# EAGLE design armstrap_eagle_1.0.0 (EAGLE 6.3)
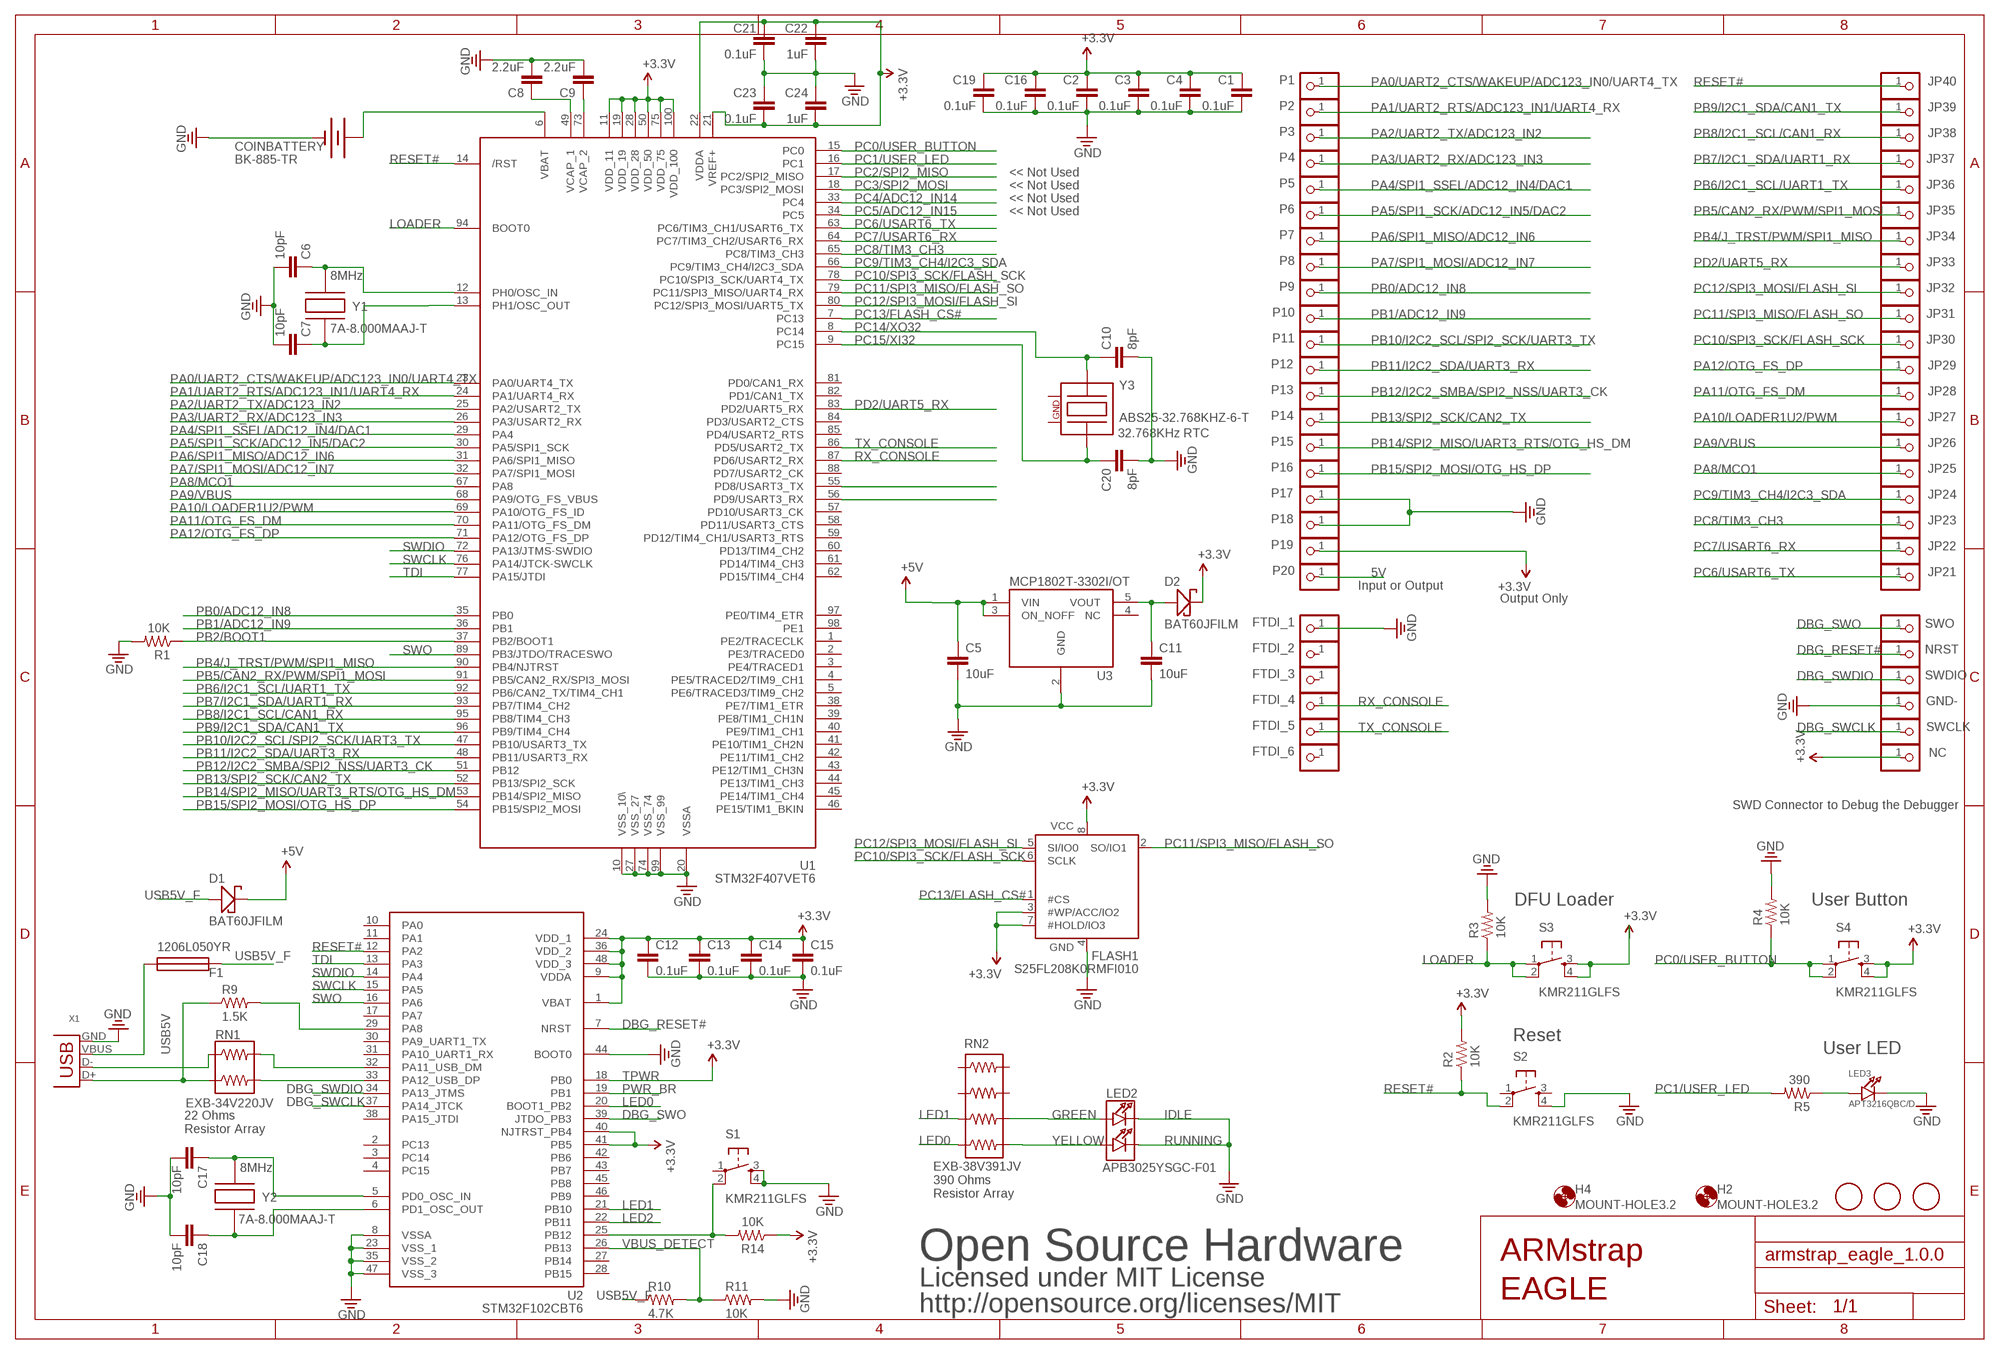
[diagram p0: schematic, sheet 1]

## Parts
C1  0.1uF  CAP0805  [0805]
C2  0.1uF  CAP0805  [0805]
C3  0.1uF  CAP0805  [0805]
C4  0.1uF  CAP0805  [0805]
C5  10uF  CAP0805  [0805]
C6  10pF  CAP0805  [0805]
C7  10pF  CAP0805  [0805]
C8  2.2uF  CAP0805  [0805]
C9  2.2uF  CAP0805  [0805]
C10  8pF  CAP0805  [0805]
C11  10uF  CAP0805  [0805]
C12  0.1uF  CAP0805  [0805]
C13  0.1uF  CAP0805  [0805]
C14  0.1uF  CAP0805  [0805]
C15  0.1uF  CAP0805  [0805]
C16  0.1uF  CAP0805  [0805]
C17  10pF  CAP0805  [0805]
C18  10pF  CAP0805  [0805]
C19  0.1uF  CAP0805  [0805]
C20  8pF  CAP0805  [0805]
C21  0.1uF  CAP0805  [0805]
C22  1uF  CAP0805  [0805]
C23  0.1uF  CAP0805  [0805]
C24  1uF  CAP0805  [0805]
COINBATTERY  BK-885-TR  BATTERY12MM  [BATTCON_12MM]
D1  BAT60JFILM  SCHOTTKY  [SOD-323]
D2  BAT60JFILM  SCHOTTKY  [SOD-323]
F1  1206L050YR  FUSE_PTC  [PTC-1206]
FID2  FIDUCIAL  [FIDUCIAL_1MM]
FID3  FIDUCIAL  [FIDUCIAL_1MM]
FID4  FIDUCIAL  [FIDUCIAL_1MM]
FLASH1  S25FL208K0RMFI010  FLASH-SPI  [SOIC-8-WIDE]
FTDI_1  PINHD-1X1  [1X01]
FTDI_2  PINHD-1X1  [1X01]
FTDI_3  PINHD-1X1  [1X01]
FTDI_4  PINHD-1X1  [1X01]
FTDI_5  PINHD-1X1  [1X01]
FTDI_6  PINHD-1X1  [1X01]
GND-  PINHD-1X1  [1X01]
H2  MOUNT-HOLE3.2  [3,2]
H4  MOUNT-HOLE3.2  [3,2]
JP21  PINHD-1X1  [1X01]
JP22  PINHD-1X1  [1X01]
JP23  PINHD-1X1  [1X01]
JP24  PINHD-1X1  [1X01]
JP25  PINHD-1X1  [1X01]
JP26  PINHD-1X1  [1X01]
JP27  PINHD-1X1  [1X01]
JP28  PINHD-1X1  [1X01]
JP29  PINHD-1X1  [1X01]
JP30  PINHD-1X1  [1X01]
JP31  PINHD-1X1  [1X01]
JP32  PINHD-1X1  [1X01]
JP33  PINHD-1X1  [1X01]
JP34  PINHD-1X1  [1X01]
JP35  PINHD-1X1  [1X01]
JP36  PINHD-1X1  [1X01]
JP37  PINHD-1X1  [1X01]
JP38  PINHD-1X1  [1X01]
JP39  PINHD-1X1  [1X01]
JP40  PINHD-1X1  [1X01]
LED2  APB3025YSGC-F01  LED-2  [CHIPLED_1206-DUAL]
LED3  APT3216QBC/D  LED1206  [CHIPLED_1206]
NC  PINHD-1X1  [1X01]
NRST  PINHD-1X1  [1X01]
P1  PINHD-1X1  [1X01]
P2  PINHD-1X1  [1X01]
P3  PINHD-1X1  [1X01]
P4  PINHD-1X1  [1X01]
P5  PINHD-1X1  [1X01]
P6  PINHD-1X1  [1X01]
P7  PINHD-1X1  [1X01]
P8  PINHD-1X1  [1X01]
P9  PINHD-1X1  [1X01]
P10  PINHD-1X1  [1X01]
P11  PINHD-1X1  [1X01]
P12  PINHD-1X1  [1X01]
P13  PINHD-1X1  [1X01]
P14  PINHD-1X1  [1X01]
P15  PINHD-1X1  [1X01]
P16  PINHD-1X1  [1X01]
P17  PINHD-1X1  [1X01]
P18  PINHD-1X1  [1X01]
P19  PINHD-1X1  [1X01]
P20  PINHD-1X1  [1X01]
R1  10K  RES0805  [0805]
R2  10K  RES0805  [0805]
R3  10K  RES0805  [0805]
R4  10K  RES0805  [0805]
R5  390  RES0805  [0805]
R9  1.5K  RES0805  [0805]
R10  4.7K  RES0805  [0805]
R11  10K  RES0805  [0805]
R14  10K  RES0805  [0805]
RN1  EXB-34V220JV  RES-2  [0603-ARC2]
RN2  EXB-38V391JV  RES-4  [0603-ARC4]
S1  KMR211GLFS  TAC_SWITCH  [KMR_SWITCH]
S2  KMR211GLFS  TAC_SWITCH  [KMR_SWITCH]
S3  KMR211GLFS  TAC_SWITCH  [KMR_SWITCH]
S4  KMR211GLFS  TAC_SWITCH  [KMR_SWITCH]
SWCLK  PINHD-1X1  [1X01]
SWDIO  PINHD-1X1  [1X01]
SWO  PINHD-1X1  [1X01]
U1  STM32F407VET6  [LQFP100]
U2  STM32F102CBT6  [LQFP48]
U3  MCP1802T-3302I/OT  MCP1802  [MCP1802-SOT23]
X1  10033526-N3212MLF  USB-MB-S  [USB-MB-S]
Y1  7A-8.000MAAJ-T  CRYSTAL-2  [CRYSTAL-SMD-5.0MM-3.2MM-2]
Y2  7A-8.000MAAJ-T  CRYSTAL-2  [CRYSTAL-SMD-5.0MM-3.2MM-2]
Y3  ABS25-32.768KHZ-6-T  CRYSTAL  [CRYSTAL-SMD-32.768KHZ]

## Nets
3.3V: C1.1 C2.1 C3.1 C4.1 C12.1 C13.1 C14.1 C15.1 C16.1 C19.1 C21.1 C22.1 C23.2 C24.2 D2.CATHODE(C) FLASH1.3(#WP/ACC/IO2) FLASH1.7(#HOLD/IO3) FLASH1.8(VCC) NC.1 P19.1 R2.2 R14.1 S3.3 S3.4 S4.3 S4.4 U1.11(VDD_11) U1.19(VDD_19) U1.21(VREF+) U1.22(VDDA) U1.28(VDD_28) U1.50(VDD_50) U1.75(VDD_75) U1.100(VDD_100) U2.1(VBAT) U2.9(VDDA) U2.18(PB0) U2.24(VDD_1) U2.36(VDD_2) U2.40(NJTRST_PB4) U2.41(PB5) U2.48(VDD_3) ; supply symbol labelled +3.3V
5V: C5.1 D1.CATHODE(C) P20.1 U3.1(VIN) U3.3(ON_NOFF) ; supply symbol labelled +5V
DBG_RESET#: NRST.1 U2.7(NRST)
DBG_SWCLK: SWCLK.1 U2.37(PA14_JTCK)
DBG_SWDIO: SWDIO.1 U2.34(PA13_JTMS)
DBG_SWO: SWO.1 U2.39(JTDO_PB3)
GND [power]: C1.2 C2.2 C3.2 C4.2 C5.2 C6.2 C7.2 C8.2 C9.2 C10.2 C11.2 C12.2 C13.2 C14.2 C15.2 C16.2 C17.2 C18.2 C19.2 C20.2 C21.2 C22.2 C23.1 C24.1 COINBATTERY.GND(-) FLASH1.4(GND) FTDI_1.1 GND-.1 LED2.2 LED2.4 LED3.C P17.1 P18.1 R1.2 R3.2 R4.2 R11.2 S1.3 S1.4 S2.4 U1.10(VSS_10\) U1.20(VSSA) U1.27(VSS_27) U1.74(VSS_74) U1.99(VSS_99) U2.8(VSSA) U2.23(VSS_1) U2.35(VSS_2) U2.44(BOOT0) U2.47(VSS_3) U3.2(GND) X1.GND
LED0: RN2.4 U2.20(BOOT1_PB2)
LED1: RN2.3 U2.21(PB10)
LED2: U2.22(PB11)
LOADER: R3.1 S3.1 S3.2 U1.94(BOOT0)
N$1: C7.1 U1.13(PH1/OSC_OUT) Y1.2
N$2: C9.1 U1.73(VCAP_2)
N$3: U1.55(PD8/USART3_TX)
N$4: C17.1 U2.5(PD0_OSC_IN) Y2.1
N$6: R9.2 U2.29(PA8)
N$8: R9.1 RN1.2 X1.D+
N$9: RN1.3 U2.33(PA12_USB_DP)
N$10: RN1.1 X1.D-
N$11: RN1.4 U2.32(PA11_USB_DM)
N$12: C11.1 D2.ANODE(A) U3.5(VOUT)
N$13: C18.1 U2.6(PD1_OSC_OUT) Y2.2
N$16: U1.56(PD9/USART3_RX)
N$17: R14.2 S1.2 U2.25(PB12)
N$20: LED3.A R5.1
N$23: LED2.3 RN2.6
N$25: LED2.1 RN2.5
N$81: C8.1 U1.49(VCAP_1)
PA0/UART2_CTS/WAKEUP/ADC123_IN0/UART4_TX: P1.1 U1.23(PA0/UART4_TX)
PA1/UART2_RTS/ADC123_IN1/UART4_RX: P2.1 U1.24(PA1/UART4_RX)
PA2/UART2_TX/ADC123_IN2: P3.1 U1.25(PA2/USART2_TX)
PA3/UART2_RX/ADC123_IN3: P4.1 U1.26(PA3/USART2_RX)
PA4/SPI1_SSEL/ADC12_IN4/DAC1: P5.1 U1.29(PA4)
PA5/SPI1_SCK/ADC12_IN5/DAC2: P6.1 U1.30(PA5/SPI1_SCK)
PA6/SPI1_MISO/ADC12_IN6: P7.1 U1.31(PA6/SPI1_MISO)
PA7/SPI1_MOSI/ADC12_IN7: P8.1 U1.32(PA7/SPI1_MOSI)
PA8/MCO1: JP25.1 U1.67(PA8)
PA9/VBUS: JP26.1 U1.68(PA9/OTG_FS_VBUS)
PA10/LOADER1U2/PWM: JP27.1 U1.69(PA10/OTG_FS_ID)
PA11/OTG_FS_DM: JP28.1 U1.70(PA11/OTG_FS_DM)
PA12/OTG_FS_DP: JP29.1 U1.71(PA12/OTG_FS_DP)
PB0/ADC12_IN8: P9.1 U1.35(PB0)
PB1/ADC12_IN9: P10.1 U1.36(PB1)
PB2/BOOT1: R1.1 U1.37(PB2/BOOT1)
PB4/J_TRST/PWM/SPI1_MISO: JP34.1 U1.90(PB4/NJTRST)
PB5/CAN2_RX/PWM/SPI1_MOSI: JP35.1 U1.91(PB5/CAN2_RX/SPI3_MOSI)
PB6/I2C1_SCL/UART1_TX: JP36.1 U1.92(PB6/CAN2_TX/TIM4_CH1)
PB7/I2C1_SDA/UART1_RX: JP37.1 U1.93(PB7/TIM4_CH2)
PB8/I2C1_SCL/CAN1_RX: JP38.1 U1.95(PB8/TIM4_CH3)
PB9/I2C1_SDA/CAN1_TX: JP39.1 U1.96(PB9/TIM4_CH4)
PB10/I2C2_SCL/SPI2_SCK/UART3_TX: P11.1 U1.47(PB10/USART3_TX)
PB11/I2C2_SDA/UART3_RX: P12.1 U1.48(PB11/USART3_RX)
PB12/I2C2_SMBA/SPI2_NSS/UART3_CK: P13.1 U1.51(PB12)
PB13/SPI2_SCK/CAN2_TX: P14.1 U1.52(PB13/SPI2_SCK)
PB14/SPI2_MISO/UART3_RTS/OTG_HS_DM: P15.1 U1.53(PB14/SPI2_MISO)
PB15/SPI2_MOSI/OTG_HS_DP: P16.1 U1.54(PB15/SPI2_MOSI)
PC0/USER_BUTTON: R4.1 S4.1 S4.2 U1.15(PC0)
PC1/USER_LED: R5.2 U1.16(PC1)
PC2/SPI2_MISO: U1.17(PC2/SPI2_MISO)
PC3/SPI2_MOSI: U1.18(PC3/SPI2_MOSI)
PC4/ADC12_IN14: U1.33(PC4)
PC5/ADC12_IN15: U1.34(PC5)
PC6/USART6_TX: JP21.1 U1.63(PC6/TIM3_CH1/USART6_TX)
PC7/USART6_RX: JP22.1 U1.64(PC7/TIM3_CH2/USART6_RX)
PC8/TIM3_CH3: JP23.1 U1.65(PC8/TIM3_CH3)
PC9/TIM3_CH4/I2C3_SDA: JP24.1 U1.66(PC9/TIM3_CH4/I2C3_SDA)
PC10/SPI3_SCK/FLASH_SCK: FLASH1.6(SCLK) JP30.1 U1.78(PC10/SPI3_SCK/UART4_TX)
PC11/SPI3_MISO/FLASH_SO: FLASH1.2(SO/IO1) JP31.1 U1.79(PC11/SPI3_MISO/UART4_RX)
PC12/SPI3_MOSI/FLASH_SI: FLASH1.5(SI/IO0) JP32.1 U1.80(PC12/SPI3_MOSI/UART5_TX)
PC13/FLASH_CS#: FLASH1.1(#CS) U1.7(PC13)
PC14/XO32: C10.1 U1.8(PC14) Y3.1
PC15/XI32: C20.1 U1.9(PC15) Y3.4
PD2/UART5_RX: JP33.1 U1.83(PD2/UART5_RX)
PWR_BR: U2.19(PB1)
RESET#: JP40.1 R2.1 S2.2 U1.14(/RST) U2.12(PA2)
RX_CONSOLE: FTDI_4.1 U1.87(PD6/USART2_RX)
SWCLK: U1.76(PA14/JTCK-SWCLK) U2.15(PA5)
SWDIO: U1.72(PA13/JTMS-SWDIO) U2.14(PA4)
SWO: U1.89(PB3/JTDO/TRACESWO) U2.16(PA6)
TDI: U1.77(PA15/JTDI) U2.13(PA3)
TX_CONSOLE: FTDI_5.1 U1.86(PD5/USART2_TX)
USB5V: F1.1 X1.VBUS
USB5V_F: D1.ANODE(A) F1.2 R10.1
VBAT: COINBATTERY.PWR@2(+) U1.6(VBAT)
VBUS_DETECT: R10.2 R11.1 U2.26(PB13)
XTAL3: C6.1 U1.12(PH0/OSC_IN) Y1.1
Unconnected: FTDI_2.1 FTDI_3.1 FTDI_6.1 RN2.1 RN2.2 RN2.7 RN2.8 S1.1 S2.1 S2.3 U1.1(PE2/TRACECLK) U1.2(PE3/TRACED0) U1.3(PE4/TRACED1) U1.4(PE5/TRACED2/TIM9_CH1) U1.5(PE6/TRACED3/TIM9_CH2) U1.38(PE7/TIM1_ETR) U1.39(PE8/TIM1_CH1N) U1.40(PE9/TIM1_CH1) U1.41(PE10/TIM1_CH2N) U1.42(PE11/TIM1_CH2) U1.43(PE12/TIM1_CH3N) U1.44(PE13/TIM1_CH3) U1.45(PE14/TIM1_CH4) U1.46(PE15/TIM1_BKIN) U1.57(PD10/USART3_CK) U1.58(PD11/USART3_CTS) U1.59(PD12/TIM4_CH1/USART3_RTS) U1.60(PD13/TIM4_CH2) U1.61(PD14/TIM4_CH3) U1.62(PD15/TIM4_CH4) U1.81(PD0/CAN1_RX) U1.82(PD1/CAN1_TX) U1.84(PD3/USART2_CTS) U1.85(PD4/USART2_RTS) U1.88(PD7/USART2_CK) U1.97(PE0/TIM4_ETR) U1.98(PE1) U2.2(PC13) U2.3(PC14) U2.4(PC15) U2.10(PA0) U2.11(PA1) U2.17(PA7) U2.27(PB14) U2.28(PB15) U2.30(PA9_UART1_TX) U2.31(PA10_UART1_RX) U2.38(PA15_JTDI) U2.42(PB6) U2.43(PB7) U2.45(PB8) U2.46(PB9) U3.4(NC)

## Notes on the sheet
- << Not Used
- << Not Used
- << Not Used
- << Not Used
- 8MHz
- 32.768KHz RTC
- Input or Output
- Output Only
- SWD Connector to Debug the Debugger
- DFU Loader | User Button
- Reset
- User LED
- TPWR
- GREEN | IDLE
- 22 Ohms
  Resistor Array
- YELLOW | RUNNING
- 8MHz
- 390 Ohms
  Resistor Array
- Open Source Hardware | ARMstrap
- Licensed under MIT License
- EAGLE
- http://opensource.org/licenses/MIT

## Power pins joined to a net without a drawn wire
2: Y3.2
4: Y3.3

## Library data of the parts
C1-C24 = vovtech:CAP: Capacitor
COINBATTERY = vovtech:BATTERY: Battery Holders Various common sizes : AA, AAA, 20mm coin cell and 12mm coin cell.
D1 D2 = vovtech:SCHOTTKY
F1 = vovtech:FUSE_PTC: POLY-FUSE Resettable PTCs The 1206L Series PTC provides surface mount overcurrent protection for applications where space is at a premium and resettable protection is desired.; MPN: 1206L050YR
FID2-FID4 = vovtech:FIDUCIAL: For use by pick and place machines to calibrate the vision/machine, 1mm By microbuilder.eu
FLASH1 = vovtech:FLASH-SPI
FTDI_1-FTDI_6 GND- JP21-JP40 NC NRST P1-P20 SWCLK SWDIO SWO = pinhead:PINHD-1X1: PIN HEADER
H2 H4 = vovtech:MOUNT-HOLE: MOUNTING HOLE with drill center marker
LED2 = vovtech:LED-2
LED3 = vovtech:LED: LED 0603 - 0603 Surface Mount Package Green LED - Low Power (3.9mcd, 2ma, 1.7Vf) Orange LED - Low Power (9.8mcd, 2ma, 1.8Vf) Red LED - Low Power (5mcd, 2ma, 1.8Vf) Yellow LED - Low Power (7mcd, 2ma, 1.8Vf) 0805 - 0805 Surface Mount Package 20mA: Red LED (104mcd, 20mA, Diffused) - LS R976 [Digikey: 475-1278-6-ND] Red LED (12mcd, 20mA, 2.0Vf, Clear) - APT2012EC [Digikey: 754-1128-1-ND] Green LED (15mcd, 20mA, 2.2Vf, Clear) - APT2012GC [Digikey: 754-1131-1-ND] Orange LED (160mcd, 20mA, 2.1Vf, Clear) - APT2012SECK [Digikey: 754-1130-1-ND] 2mA: Red LED (8.8mcd, 2mA, 1.8Vf, Clear) - Low Power [Digikey: 475-2510-1-ND] Green LED (5mcd, 2mA, 1.8Vf, Clear) - Low Power [Digikey: 475-2730-1-ND] Yellow LED (11.3mcd, 2mA, 1.8Vf, Clear) - Low Power [Digikey: 475-2555-1-ND] 1206 - 1206 Surface Mount Package Green LED (26mcd, 20mA, Diffused) - LG N971 [Digikey: 475-1407-6-ND] Red LED (15mcd, 20mA, Diffused) - LH N974 [Digikey: 475-1416-6-ND]
R1-R5 R9-R11 R14 = vovtech:RES: Resistor
RN1 = vovtech:RES-2
RN2 = vovtech:RES-4: Array Chip Resistor Source: RS Component / Phycomp
S1-S4 = vovtech:TAC_SWITCH: Momentary Switch Button commonly used for reset or general input. Spark Fun Electronics SKU : COM-00097
U1 = vovtech:STM32F407VET6
U2 = vovtech:STM32F102CBT6
U3 = vovtech:MCP1802
X1 = vovtech:USB: USB Connectors
Y1 Y2 = vovtech:CRYSTAL-2
Y3 = vovtech:CRYSTAL

## Board
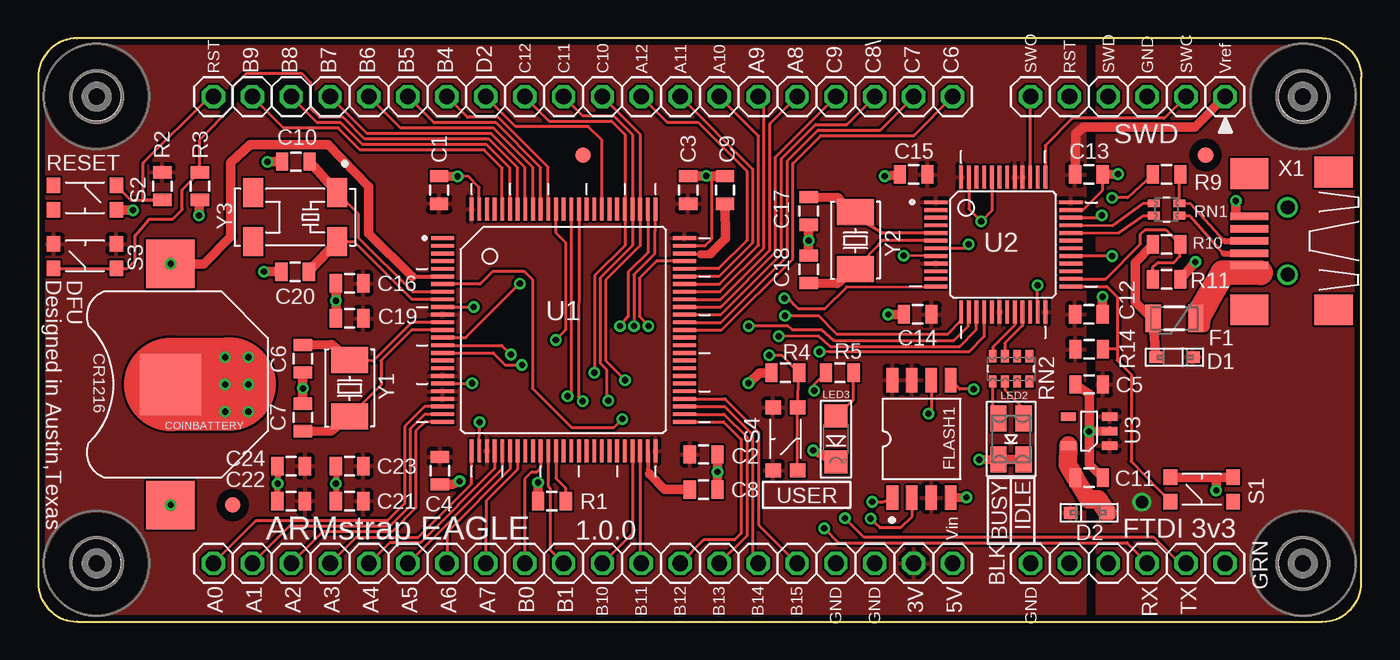
[diagram p1: board, top side]
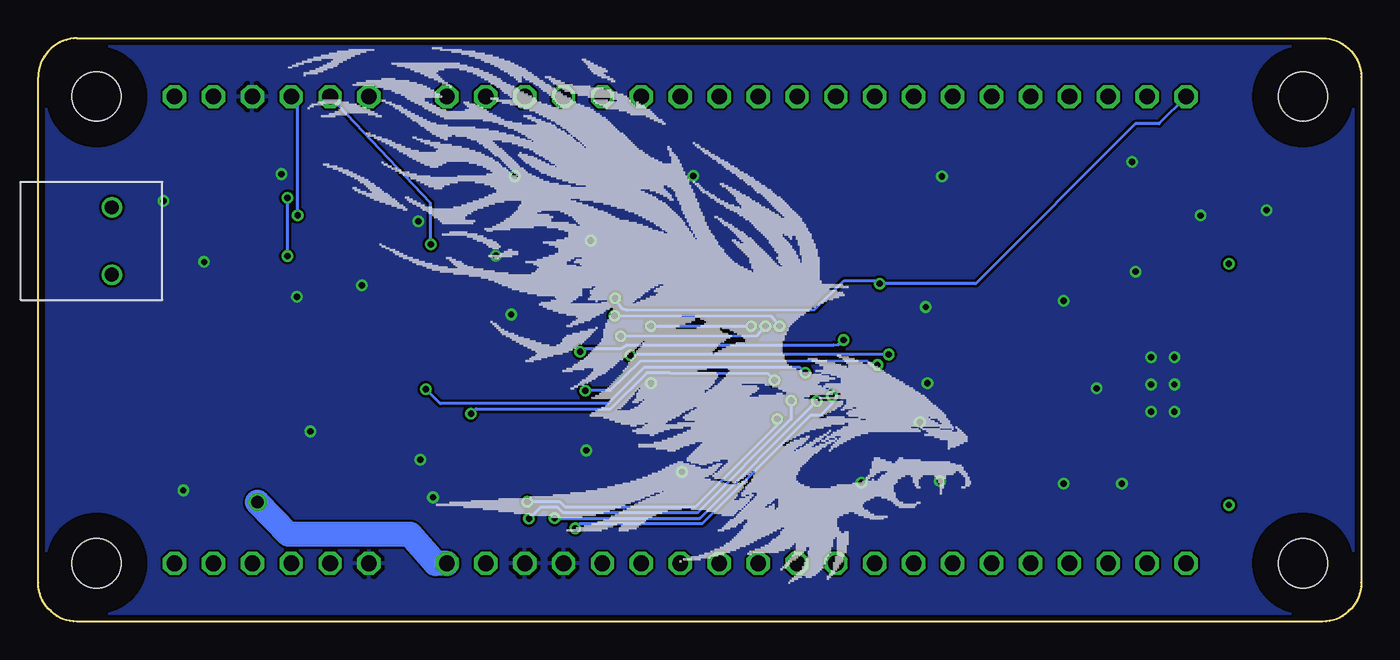
[diagram p2: board, bottom side, seen from below]

Size 86.36 x 38.1 mm. Coordinates in mm from the lower left corner, seen from the top.
Outline: 2.54,0 83.82,0 arc90 86.36,2.54 86.36,35.56 arc90 83.82,38.1 2.54,38.1 arc90 0,35.56 0,2.54 arc90 2.54,0
Copper layers (1*16): Top 0.0356mm / dielectric 1.5011mm / Bottom 0.0356mm
Design rules "LaenPCBOrder *": minimum track width 6mil, minimum drill 13mil, track to track 6mil, track to pad 6mil, pad to pad 6mil, via to via 6mil, smd to smd 6mil, copper to edge 15mil, drill to drill 6mil, minimum pad ring 7mil, minimum via ring 7mil, stop-mask expansion 4mil, vias tented up to drill 16mil, thermal gap 10mil

### Footprints (pad centres in the part's own frame; a part is rotated, then mirrored left to right if it is on the bottom)
0805 = smd 0.8 x 1.2: 1 -0.9,0; 2 0.9,0
BATTCON_12MM = smd 3.962 x 3.962: GND 0,0 | smd 3.175 x 3.175: PWR@1 -7.874,0; PWR@2 7.874,0
SOD-323 = smd 0.889 x 0.762: ANODE 1.206,0; CATHODE -1.206,0
PTC-1206 = smd 1 x 1.8: 1 -1.4,0; 2 1.4,0
FIDUCIAL_1MM = smd 1 x 1: 1 0,0
SOIC-8-WIDE = smd 0.762 x 1.6: 1 -1.905,-3.84; 2 -0.635,-3.84; 3 0.635,-3.84; 4 1.905,-3.84; 5 1.905,3.84; 6 0.635,3.84; 7 -0.635,3.84; 8 -1.905,3.84
1X01 = drill 1.016 octagon: 1 0,0
3,2 = hole 3.2: 0,0
CHIPLED_1206-DUAL = smd 1.7 x 1.05: 1 1.35,0.825; 2 -1.35,0.825; 3 1.35,-0.825; 4 -1.35,-0.825
CHIPLED_1206 = smd 1.5 x 1.5: A 1.496,0; C -1.496,0
0603-ARC2 = smd 0.5 x 0.8: 1 -0.403,-0.82; 2 0.397,-0.82; 3 0.397,0.83; 4 -0.403,0.83
0603-ARC4 = smd 0.5 x 0.8: 1 -1.2,-0.825; 2 -0.4,-0.825; 3 0.4,-0.825; 4 1.2,-0.825; 5 1.2,0.825; 6 0.4,0.825; 7 -0.4,0.825; 8 -1.2,0.825
KMR_SWITCH = smd 0.9 x 1: 1 -2.05,0.8; 2 2.05,0.8; 3 -2.05,-0.8; 4 2.05,-0.8
LQFP100 = smd 0.25 x 1.5: 1 -6,-7.9; 2 -5.5,-7.9; 3 -5,-7.9; 4 -4.5,-7.9; 5 -4,-7.9; 6 -3.5,-7.9; 7 -3,-7.9; 8 -2.5,-7.9; 9 -2,-7.9; 10 -1.5,-7.9; 11 -1,-7.9; 12 -0.5,-7.9; 13 0,-7.9; 14 0.5,-7.9; 15 1,-7.9; 16 1.5,-7.9; 17 2,-7.9; 18 2.5,-7.9; 19 3,-7.9; 20 3.5,-7.9; 21 4,-7.9; 22 4.5,-7.9; 23 5,-7.9; 24 5.5,-7.9; 25 6,-7.9; 51 6,7.9; 52 5.5,7.9; 53 5,7.9; 54 4.5,7.9; 55 4,7.9; 56 3.5,7.9; 57 3,7.9; 58 2.5,7.9; 59 2,7.9; 60 1.5,7.9; 61 1,7.9; 62 0.5,7.9; 63 0,7.9; 64 -0.5,7.9; 65 -1,7.9; 66 -1.5,7.9; 67 -2,7.9; 68 -2.5,7.9; 69 -3,7.9; 70 -3.5,7.9; 71 -4,7.9; 72 -4.5,7.9; 73 -5,7.9; 74 -5.5,7.9; 75 -6,7.9 | smd 1.5 x 0.25: 26 7.9,-6; 27 7.9,-5.5; 28 7.9,-5; 29 7.9,-4.5; 30 7.9,-4; 31 7.9,-3.5; 32 7.9,-3; 33 7.9,-2.5; 34 7.9,-2; 35 7.9,-1.5; 36 7.9,-1; 37 7.9,-0.5; 38 7.9,0; 39 7.9,0.5; 40 7.9,1; 41 7.9,1.5; 42 7.9,2; 43 7.9,2.5; 44 7.9,3; 45 7.9,3.5; 46 7.9,4; 47 7.9,4.5; 48 7.9,5; 49 7.9,5.5; 50 7.9,6; 76 -7.9,6; 77 -7.9,5.5; 78 -7.9,5; 79 -7.9,4.5; 80 -7.9,4; 81 -7.9,3.5; 82 -7.9,3; 83 -7.9,2.5; 84 -7.9,2; 85 -7.9,1.5; 86 -7.9,1; 87 -7.9,0.5; 88 -7.9,0; 89 -7.9,-0.5; 90 -7.9,-1; 91 -7.9,-1.5; 92 -7.9,-2; 93 -7.9,-2.5; 94 -7.9,-3; 95 -7.9,-3.5; 96 -7.9,-4; 97 -7.9,-4.5; 98 -7.9,-5; 99 -7.9,-5.5; 100 -7.9,-6
LQFP48 = smd 0.25 x 1.5: 1 -2.75,-4.4; 2 -2.25,-4.4; 3 -1.75,-4.4; 4 -1.25,-4.4; 5 -0.75,-4.4; 6 -0.25,-4.4; 7 0.25,-4.4; 8 0.75,-4.4; 9 1.25,-4.4; 10 1.75,-4.4; 11 2.25,-4.4; 12 2.75,-4.4; 25 2.75,4.4; 26 2.25,4.4; 27 1.75,4.4; 28 1.25,4.4; 29 0.75,4.4; 30 0.25,4.4; 31 -0.25,4.4; 32 -0.75,4.4; 33 -1.25,4.4; 34 -1.75,4.4; 35 -2.25,4.4; 36 -2.75,4.4 | smd 1.5 x 0.25: 13 4.4,-2.75; 14 4.4,-2.25; 15 4.4,-1.75; 16 4.4,-1.25; 17 4.4,-0.75; 18 4.4,-0.25; 19 4.4,0.25; 20 4.4,0.75; 21 4.4,1.25; 22 4.4,1.75; 23 4.4,2.25; 24 4.4,2.75; 37 -4.4,2.75; 38 -4.4,2.25; 39 -4.4,1.75; 40 -4.4,1.25; 41 -4.4,0.75; 42 -4.4,0.25; 43 -4.4,-0.25; 44 -4.4,-0.75; 45 -4.4,-1.25; 46 -4.4,-1.75; 47 -4.4,-2.25; 48 -4.4,-2.75
MCP1802-SOT23 = smd 1 x 0.55: 1 1.35,-0.95; 2 1.35,0; 3 1.35,0.95; 4 -1.35,0.95; 5 -1.35,-0.95
USB-MB-S = smd 2.5 x 0.5: D+ -3.77,0; D- -3.77,-0.8; GND -3.77,1.6; ID -3.77,0.8; VBUS -3.77,-1.6 | smd 2.5 x 2: P$1 1.73,4.5; P$2 1.73,-4.5; P$3 -3.77,4.4; P$4 -3.77,-4.5 | drill 0.9: P$5 -1.27,-2.2; P$6 -1.27,2.2
CRYSTAL-SMD-5.0MM-3.2MM-2 = smd 1.7 x 2.4: 1 -1.85,0; 2 1.85,0
CRYSTAL-SMD-32.768KHZ = smd 1.3 x 1.9: 1 -2.75,-1.6; 2 2.75,-1.6; 3 2.75,1.6; 4 -2.75,1.6

### Placement (x,y rotation side)
C1  26.16,28.19 90 top
C2  43.43,10.92 0 top
C3  42.42,28.19 90 top
C4  26.21,9.86 270 top
C5  68.59,15.49 180 top
C6  17.27,17.17 270 top
C7  17.27,13.34 90 top
C8  43.43,8.64 0 top
C9  44.83,28.19 90 top
C10  16.81,30.05 180 top
C11  68.59,9.4 0 top
C12  68.58,20.07 0 top
C13  68.58,29.21 0 top
C14  57.4,20.07 180 top
C15  57.15,29.21 180 top
C16  20.32,22.1 180 top
C17  50.29,26.82 270 top
C18  50.29,23.01 90 top
C19  20.32,19.81 180 top
C20  16.76,22.86 180 top
C21  20.32,7.87 180 top
C22  16.51,7.87 180 top
C23  20.32,10.16 0 top
C24  16.51,10.16 0 top
COINBATTERY  8.64,15.49 90 top
D1  74.17,17.27 180 top
D2  68.59,7.11 0 top
F1  74.17,19.81 180 top
FID2  76.2,30.48 0 top
FID3  12.7,7.62 0 top
FID4  35.56,30.48 0 top
FLASH1  57.66,11.94 0 top
FTDI_1  64.77,3.81 0 top
FTDI_2  67.31,3.81 0 top
FTDI_3  69.85,3.81 0 top
FTDI_4  72.39,3.81 0 top
FTDI_5  74.93,3.81 0 top
FTDI_6  77.47,3.81 0 top
GND-  72.39,34.29 0 top
H1  MOUNT-HOLE3.2  [3,2]  82.55,34.29 0 top
H2  82.55,3.81 0 top
H3  MOUNT-HOLE3.2  [3,2]  3.81,34.29 0 top
H4  3.81,3.81 0 top
JP21  59.69,34.29 0 top
JP22  57.15,34.29 0 top
JP23  54.61,34.29 0 top
JP24  52.07,34.29 0 top
JP25  49.53,34.29 0 top
JP26  46.99,34.29 0 top
JP27  44.45,34.29 0 top
JP28  41.91,34.29 0 top
JP29  39.37,34.29 0 top
JP30  36.83,34.29 0 top
JP31  34.29,34.29 0 top
JP32  31.75,34.29 0 top
JP33  29.21,34.29 0 top
JP34  26.67,34.29 0 top
JP35  24.13,34.29 0 top
JP36  21.59,34.29 0 top
JP37  19.05,34.29 0 top
JP38  16.51,34.29 0 top
JP39  13.97,34.29 0 top
JP40  11.43,34.29 0 top
LED2  63.5,11.94 90 top
LED3  52.07,11.94 90 top
NC  77.47,34.29 0 top
NRST  67.31,34.29 0 top
P1  11.43,3.81 0 top
P2  13.97,3.81 90 top
P3  16.51,3.81 90 top
P4  19.05,3.81 90 top
P5  21.59,3.81 90 top
P6  24.13,3.81 90 top
P7  26.67,3.81 90 top
P8  29.21,3.81 90 top
P9  31.75,3.81 90 top
P10  34.29,3.81 90 top
P11  36.83,3.81 90 top
P12  39.37,3.81 90 top
P13  41.91,3.81 90 top
P14  44.45,3.81 90 top
P15  46.99,3.81 90 top
P16  49.53,3.81 90 top
P17  52.07,3.81 90 top
P18  54.61,3.81 90 top
P19  57.15,3.81 90 top
P20  59.69,3.81 90 top
R1  33.53,7.87 180 top
R2  8.1,28.45 90 top
R3  10.54,28.45 270 top
R4  48.77,16.26 180 top
R5  52.32,16.26 180 top
R9  73.66,29.21 180 top
R10  73.66,24.64 0 top
R11  73.66,22.35 0 top
R14  68.59,17.78 0 top
RN1  73.66,26.92 90 top
RN2  63.5,16.51 180 top
S1  75.95,8.64 180 top
S2  3.05,27.69 0 top
S3  3.05,23.88 180 top
S4  48.77,11.94 270 top
SWCLK  74.93,34.29 0 top
SWDIO  69.85,34.29 0 top
SWO  64.77,34.29 0 top
U1  34.29,19.05 270 top
U2  62.99,24.64 270 top
U3  68.59,12.45 0 top
X1  82.83,24.86 0 top
Y1  20.32,15.24 270 top
Y2  53.34,24.89 270 top
Y3  16.76,26.42 180 top

### Tracks (layer width: path | path; a pad name or v marks a point on that pad's centre or on a via)
3.3V
  Top 0.61: NC.1 75.49,32.31 68.21,32.29 67.73,31.88 C13.1
  pour Top: -0.76,39.37 68.33,39.37 68.33,-1.27 0,-1.27
5V  (via drill 0.81)
  Bottom 1.626: P20.1 60.43,3.81 62.1,5.71 70.02,5.72 v72.04,7.8
  pour Top: 69.09,39.37 69.09,-1.27 85.85,-1.27 85.85,39.37
DBG_RESET#  (via drill 0.41)
  Top 0.203: U2.7 60.45,24.39 v60.74,24.64
  Bottom 0.203: v60.74,24.64 60.76,27.34 NRST.1
DBG_SWCLK
  Top 0.203: SWCLK.1 73.51,32.87 67.51,32.87 65.74,31.1 U2.37
DBG_SWDIO  (via drill 0.41)
  Top 0.203: U2.34 69.23,26.39 v69.42,26.54
  Bottom 0.203: v69.42,26.54 69.44,33.89 SWDIO.1
DBG_SWO
  Top 0.203: SWO.1 64.74,34.26 U2.39
GND  (via drill 0.41)
  Top 0.203: 12.47,15.51 v12.19,15.49 | U2.8 v56.49,23.9 | U2.35 68.19,26.89 69.49,28.19 C13.2 | U2.44 62.24,26.83 v61.55,26.14 60.74,26.95 U2.47 | U1.74 43.52,24.55 43.97,24.99 43.97,28.75 v43.6,29.11 | U1.99 28.79,28.36 28.07,29.08 v27.37,29.08 | U1.10 v28.42,20.55 | U1.20 v28.32,15.57 | U2.23 v65.24,21.96 | U1.27 v28.8,13.03
  Top 0.406: X1.GND 78.18,26.54 | C24.1 v15.62,9.02 C22.2 | C23.1 v19.43,9.02 C21.2
  Top 0.61: C18.2 v50.29,24.89 C17.2 | C20.2 v14.73,22.86 | C10.2 v14.96,30.04 | v27.51,9.17 27.05,8.97 C4.2 | U3.2 v68.6,12.42 | C7.2 v17.27,15.24 C6.2 | C15.2 v55.25,29.1 | C14.2 v55.49,20.06 | C12.2 v69.48,21.23 | C13.2 v70.49,29.23 | R11.2 v75.54,23.5 | C5.2 68.6,14.88 v68.6,12.42 | C11.2 68.6,10.28 v68.6,12.42 | R4.2 47.07,16.26 v46.36,15.57 | LED3.C v50.59,11.19 | LED2.2 LED2.4 v61.42,10.58 | 78.18,26.54 v78.18,27.48 | C3.2 v43.6,29.11 C9.2 | C2.2 v44.34,9.78 C8.2 | R1.2 v32.62,9.08 | v27.37,29.08 C1.2 | C19.2 v19.43,20.95 C16.2 | R3.2 v10.48,26.53 | S2.4 v6.17,26.87 | FLASH1.4 v60.59,8.12 | S1.4 76.89,9.44 | 76.89,9.44 S1.3 | v76.89,8.58 76.89,9.44
  Top 6.096: COINBATTERY.GND 12.47,15.51
  other vias: 12.19,17.27 13.72,17.27 13.72,15.49 12.19,13.72 13.72,13.72
  pour Bottom (rank 2): 86.41,38.91 86.41,-0.41 0.2,-0.41 0.2,38.91
LED0
  Top 0.203: U2.20 63.74,19.37 62.31,17.93 RN2.4
LED1
  Top 0.203: U2.21 64.24,19.34 63.09,18.19 RN2.3
LOADER
  Top 0.203: U1.94 31.29,27.13 31.29,29.64 29.41,31.52 21.31,31.52 19.89,32.94 18.36,32.94 17.79,33.51 17.79,35.21 17.19,35.81 13.59,35.81 12.7,34.92 12.7,33.66 10.54,31.5 R3.1 9.4,28.2 9.4,26.92 8.76,26.29 7.24,26.29 6.33,25.22 6.33,23.6 5.8,23.08 S3.1 S3.2
N$1
  Top 0.203: U1.13 25.91,19.05 24.38,19.05 22.38,17.04 22.38,15.45 Y1.2
  Top 0.61: C7.1 19.12,12.45 Y1.2
N$2
  Top 0.203: U1.73 43.23,24
  Top 0.508: 43.23,24 43.89,24 43.92,24.08
  Top 0.61: C9.1 44.86,25.02 43.92,24.08
N$4
  Top 0.203: U2.5 55.09,25.38 52.83,26.75
  Top 0.61: C17.1 52.2,27.71 52.83,26.75 Y2.1
N$6  (via drill 0.41)
  Top 0.203: R9.2 71.12,27.69 v70.1,27.69 | v70.1,23.88 U2.29
  Bottom 0.203: v70.1,27.69 v70.1,23.88
N$8
  Top 0.203: R9.1 74.48,29.21 RN1.2 75.2,27.32 77.43,24.87
  Top 0.406: 77.43,24.87 78.96,24.87 X1.D+
N$9
  Top 0.203: U2.33 70.16,25.88 72.17,27.33 RN1.3
N$10
  Top 0.203: RN1.1 75.16,26.52 77.37,24.04
  Top 0.406: 77.37,24.04 78.91,24.04 X1.D-
N$11
  Top 0.203: U2.32 70.56,25.4 72.16,26.51 RN1.4
N$12
  Top 1.219: U3.5 67.22,10.23 C11.1 68.56,8 69.19,7.98 D2.ANODE
N$13
  Top 0.203: U2.6 55.09,24.89 Y2.2
  Top 0.61: C18.1 52.15,22.1 Y2.2
N$17
  Top 0.203: R14.2 69.57,17.86 70.43,17.86 | U2.25 69.75,21.89 70.43,21.21 70.43,17.86 | 70.43,17.86 70.43,17.07 71.35,16.15 71.35,10.46 S1.2
N$20
  Top 0.203: LED3.A 53.21,14.46 R5.1
N$23
  Top 0.203: RN2.6 63.1,15.13 64.26,13.97 LED2.3
N$24  (via drill 0.41)
  other vias: 8.64,7.62
N$25
  Top 0.203: RN2.5 62.3,13.66 LED2.1
N$81
  Top 0.254: U1.49 39.8,9.96 39.89,9.64
  Top 0.61: 39.89,9.64 40.89,8.64 C8.1
PA0/UART2_CTS/WAKEUP/ADC123_IN0/UART4_TX
  Top 0.203: U1.23 25.23,14.05 23.93,12.75 23.93,7.72 22.78,6.58 14.2,6.58 P1.1
PA1/UART2_RTS/ADC123_IN1/UART4_RX
  Top 0.203: P2.1 16.38,6.22 22.94,6.22 24.28,7.57 24.28,12.6 25.23,13.55 U1.24
PA2/UART2_TX/ADC123_IN2
  Top 0.203: U1.25 25.24,13.05 24.64,12.45 24.64,7.42 23.09,5.87 18.57,5.87 P3.1
PA3/UART2_RX/ADC123_IN3
  Top 0.203: 19.03,3.83 P4.1 19.17,3.93 20.75,5.51 24.79,5.51 28.29,9.01 U1.26 28.29,10.97
PA4/SPI1_SSEL/ADC12_IN4/DAC1
  Top 0.203: U1.29 29.79,10 24.94,5.16 22.94,5.16 P5.1
PA5/SPI1_SCK/ADC12_IN5/DAC2
  Top 0.203: U1.30 30.29,9.97 P6.1
PA6/SPI1_MISO/ADC12_IN6
  Top 0.203: U1.31 30.79,9.96 26.67,5.84 P7.1
PA7/SPI1_MOSI/ADC12_IN7
  Top 0.203: U1.32 31.29,9.95 29.23,7.9 P8.1
PA8/MCO1
  Top 0.203: U1.67 44.55,21.05 47.75,24.26 47.75,32.51 JP25.1
PA9/VBUS
  Top 0.203: U1.68 44.51,21.55 47.37,24.41 47.37,33.91 JP26.1
PA10/LOADER1U2/PWM
  Top 0.203: U1.69 44.48,22.05 47.02,24.59 47.02,31.73 JP27.1
PA11/OTG_FS_DM
  Top 0.203: JP28.1 46.63,29.57 46.63,24.74 44.45,22.55 U1.70
PA12/OTG_FS_DP
  Top 0.203: JP29.1 41.05,32.61 43.05,32.61 46.25,29.41 46.25,24.89 44.41,23.05 U1.71
PB0/ADC12_IN8
  Top 0.203: U1.35 32.79,10.03 32.51,9.75 32.18,9.75 31.75,9.32 P9.1
PB1/ADC12_IN9
  Top 0.203: U1.36 33.29,8.85 33.4,8.74 33.4,4.7 P10.1
PB2/BOOT1
  Top 0.203: U1.37 33.79,9.37 34.42,8.74 R1.1
PB4/J_TRST/PWM/SPI1_MISO
  Top 0.203: JP34.1 28.02,32.94 30.02,32.94 33.29,29.68 U1.90
PB5/CAN2_RX/PWM/SPI1_MOSI
  Top 0.203: U1.91 32.79,29.67 29.87,32.59 25.83,32.59 JP35.1
PB6/I2C1_SCL/UART1_TX
  Top 0.203: U1.92 32.29,29.66 29.72,32.23 23.65,32.23 JP36.1
PB7/I2C1_SDA/UART1_RX
  Top 0.203: U1.93 31.79,29.65 29.57,31.88 21.46,31.88 JP37.1
PB8/I2C1_SCL/CAN1_RX
  Top 0.203: U1.95 30.79,29.64 29.26,31.17 21.16,31.17 19.74,32.59 18.21,32.59 JP38.1
PB9/I2C1_SDA/CAN1_TX
  Top 0.203: U1.96 30.29,29.63 29.11,30.81 21.01,30.81 19.58,32.23 16.03,32.23 JP39.1
PB10/I2C2_SCL/SPI2_SCK/UART3_TX
  Top 0.203: U1.47 38.79,5.77 P11.1
PB11/I2C2_SDA/UART3_RX
  Top 0.203: U1.48 39.29,3.89 P12.1
PB12/I2C2_SMBA/SPI2_NSS/UART3_CK
  Top 0.203: U1.51 44.73,13.05 45.87,11.91 45.87,5.77 45.44,5.33 43.43,5.33 P13.1
PB13/SPI2_SCK/CAN2_TX
  Top 0.203: U1.52 44.77,13.55 46.25,12.06 46.25,5.61 P14.1
PB14/SPI2_MISO/UART3_RTS/OTG_HS_DM
  Top 0.203: U1.53 44.8,14.05 46.63,12.22 46.63,4.17 P15.1
PB15/SPI2_MOSI/OTG_HS_DP
  Top 0.203: U1.54 44.84,14.55 47.02,12.37 47.02,6.33 P16.1
PC0/USER_BUTTON  (via drill 0.41)
  Top 0.203: U1.15 30.25,18.05 v30.85,17.45 | S4.2 S4.1 R4.1 48.52,17.41 v47.71,17.41
  Bottom 0.203: v30.85,17.45 47.69,17.45 v47.71,17.41
PC1/USER_LED  (via drill 0.41)
  Top 0.203: U1.16 29.69,17.55 30.48,16.76 v31.57,16.76 | v50.65,15.09 50.65,15.48 R5.2
  Bottom 0.203: v31.57,16.76 32,16.76 32.26,17.02 47.08,16.99 49.02,15.09 v50.65,15.09
PC6/USART6_TX
  Top 0.203: U1.63 44.6,19.05 49.25,23.7 49.25,29.92 51.08,31.75 57.15,31.75 JP21.1
PC7/USART6_RX
  Top 0.203: U1.64 44.57,19.55 48.9,23.88 48.9,30.1 50.9,32.11 54.97,32.11 JP22.1
PC8/TIM3_CH3
  Top 0.203: U1.65 44.56,20.05 48.51,24 48.51,30.23 50.75,32.46 52.78,32.46 JP23.1
PC9/TIM3_CH4/I2C3_SDA
  Top 0.203: U1.66 44.55,20.55 48.13,24.13 48.13,30.35 JP24.1
PC10/SPI3_SCK/FLASH_SCK  (via drill 0.41)
  Top 0.203: JP30.1 39.29,31.83 U1.78 39.29,24.56 37.03,22.3 37.03,17.07 v38.3,15.77 | FLASH1.6 58.29,13.77 v58.12,13.59
  Bottom 0.203: v58.12,13.59 57.81,13.89 49,13.89 46.63,16.26 45.14,16.26 38.73,16.2 v38.3,15.77
PC11/SPI3_MISO/FLASH_SO  (via drill 0.41)
  Top 0.203: JP31.1 35.53,33.05 37.57,33.05 38.79,31.82 U1.79 38.79,24.57 36.68,22.45 36.68,16.89 37.11,16.46 37.11,14.53 v37.21,14.43 | v54.33,6.73 54.94,6.15 56.31,6.15 57.05,6.88 FLASH1.2
  Bottom 0.203: v37.21,14.43 37.21,13.23 43.33,7.11 52.09,7.11 52.45,7.47 53.57,7.47 v54.33,6.73
PC12/SPI3_MOSI/FLASH_SI  (via drill 0.41)
  Top 0.203: JP32.1 33.35,32.69 37.41,32.69 38.29,31.81 U1.80 38.29,24.57 36.32,22.61 v36.3,16.26 | v61.06,15.19 60.15,15.19 FLASH1.5
  Bottom 0.203: v61.06,15.19 60.12,14.25 49.17,14.25 46.81,16.61 36.65,16.61 v36.3,16.26
PC13/FLASH_CS#  (via drill 0.41)
  Top 0.203: v38.12,13.23 37.59,12.7 34.8,12.7 32.26,15.24 32.26,22.35 31.75,22.86 29.64,22.86 28.83,22.05 U1.7 | v54.43,7.82 55.14,7.82 FLASH1.1
  Bottom 0.203: v38.12,13.23 38.1,12.85 43.48,7.47 51.94,7.47 52.3,7.82 v54.43,7.82
PC14/XO32
  Top 0.203: Y3.1 20.88,26.65 20.88,25.09 24.42,21.55 U1.8
  Top 0.61: C10.1 Y3.1
PC15/XI32
  Top 0.203: Y3.4 20.62,24.82 24.39,21.05 U1.9
  Top 0.61: C20.1 Y3.4
PD2/UART5_RX
  Top 0.203: U1.83 36.79,31.43 35.89,32.33 31.17,32.33 JP33.1
RESET#  (via drill 0.41)
  Top 0.203: v48.7,21.12 48.99,21.11 49.34,20.7 49.59,20.46 51.36,20.46 52.77,21.87 U2.12 | U1.14 27.9,18.55 v31.43,22.08 | S2.2 6.04,27.55 R2.1 6.86,27.55 6.86,29.97 11.18,34.29 JP40.1
  Bottom 0.203: v48.7,21.12 48.24,20.46 47.89,20.37 35.7,20.39 33.76,22.27 31.78,22.27 v31.43,22.08 25.17,22.08 14.73,32.51 13.21,32.51 JP40.1
RX_CONSOLE  (via drill 0.41)
  Top 0.203: U1.87 34.79,14.99 v34.54,14.73 | v51.31,6.1 52.25,5.16 71.07,5.16 FTDI_4.1
  Bottom 0.203: v34.54,14.73 34.54,14.22 35.31,13.46 35.97,13.46 43.03,6.4 51,6.4 v51.31,6.1
SWCLK  (via drill 0.41)
  Top 0.203: v48.34,18.63 50.93,18.64 51.69,17.98 60.15,17.98 61.24,19.07 U2.15 | U1.76 40.26,24.05 38.89,22.66 v38.89,19.3
  Bottom 0.203: v38.89,19.3 39.43,18.66 v48.34,18.63
SWDIO  (via drill 0.41)
  Top 0.203: U2.14 60.71,19.3 59.77,18.36 51.94,18.36 51.16,19.05 49.23,19.05 48.95,19.3 v46.38,19.3 | U1.72 40.37,23.55 39.24,22.43 39.24,19.94 v39.83,19.3
  Bottom 0.203: v46.38,19.3 v39.83,19.3
SWO  (via drill 0.41)
  Top 0.203: U2.16 61.74,18.61 60.76,17.63 51.64,17.63 v50.99,17.64 | U1.89 33.78,25.4 34.42,24.77 34.42,19.05 v33.78,18.4
  Bottom 0.203: v50.99,17.64 50.78,17.84 48.34,17.83 47.94,18.08 34.42,18.08 34.12,18.09 v33.78,18.4
TDI  (via drill 0.41)
  Top 0.203: v48.74,19.98 50.92,19.98 52.13,18.77 59.36,18.77 60.24,19.65 U2.13 | U1.77 39.79,24.12 38.51,22.84 38.51,19.91 v37.97,19.3
  Bottom 0.203: v48.74,19.98 38.51,19.95 v37.97,19.3
TX_CONSOLE  (via drill 0.41)
  Top 0.203: FTDI_5.1 74.52,3.81 72.82,5.51 53.9,5.51 v52.65,6.76 | U1.86 35.26,14.68 v35.53,14.4
  Bottom 0.203: v52.65,6.76 43.18,6.76 v35.53,14.4
USB5V
  Top 0.406: 79.8,22.8 79.57,23.25 X1.VBUS
  Top 0.813: 76.04,20.57 77.03,21.82 76.63,20.75 76.12,19.81 76.07,19.3 F1.1
  Top 1.626: 79.8,22.8 77.32,22.78 76.04,20.57
USB5V_F
  Top 0.203: F1.2 72.69,19.81
  Top 0.61: D1.ANODE F1.2 | R10.1 71.63,23.47 71.63,20.88 72.69,19.81
VBAT  (via drill 0.41)
  Top 0.254: 24.39,22.55 U1.6
  Top 0.61: COINBATTERY.PWR@2 10.79,23.37 12.57,25.15 12.57,29.97 13.82,31.17 18.92,31.17 21.57,28.42 21.57,25.35 24.39,22.55
  other vias: 8.64,23.37
VBUS_DETECT
  Top 0.203: R11.1 72.75,23.16 73.1,23.47 74.12,23.47 74.52,23.88 R10.2 73.59,25.6 72.26,25.6 71.96,25.3 71.96,24.66 69.68,22.39 U2.26
XTAL3
  Top 0.203: U1.12 24.38,19.55 21.84,17.02 Y1.1
  Top 0.61: C6.1 19.16,18.09 Y1.1

### Text on the board
tPlace: BUSY | IDLE | USER
_tsilk: RST | B9 | B8 | B7 | B6 | B5 | B4 | D2 | C12 | C11 | C10 | A12 | A11 | A10 | A9 | A8 | C9 | C8\ | C7 | C6 | SWO | RST | SWD | GND | SWC | Vref | SWD | RESET | Designed in Austin,Texas | DFU | CR1216 | FTDI 3v3 | ARMstrap EAGLE | 1.0.0 | Vin | BLK | GRN | A0 | A1 | A2 | A3 | A4 | A5 | A6 | A7 | B0 | B1 | B10 | B11 | B12 | B13 | B14 | B15 | GND | GND | 3V | 5V | GND | RX | TX